# Altium schematic sheet 1166V31-5.SchDoc: HV-Input & Measurement-Driver
size A3; Author: M. Kutzsche; Organization: Kübrich Ing.-Gesellschaft; Address1: mbH & Co. KG; Address2: Weißmühle 10; Address3: D-96170 Priesendorf; DocumentNumber: UltraZohm; Revision: 31; SheetNumber: 5; SheetTotal: 5
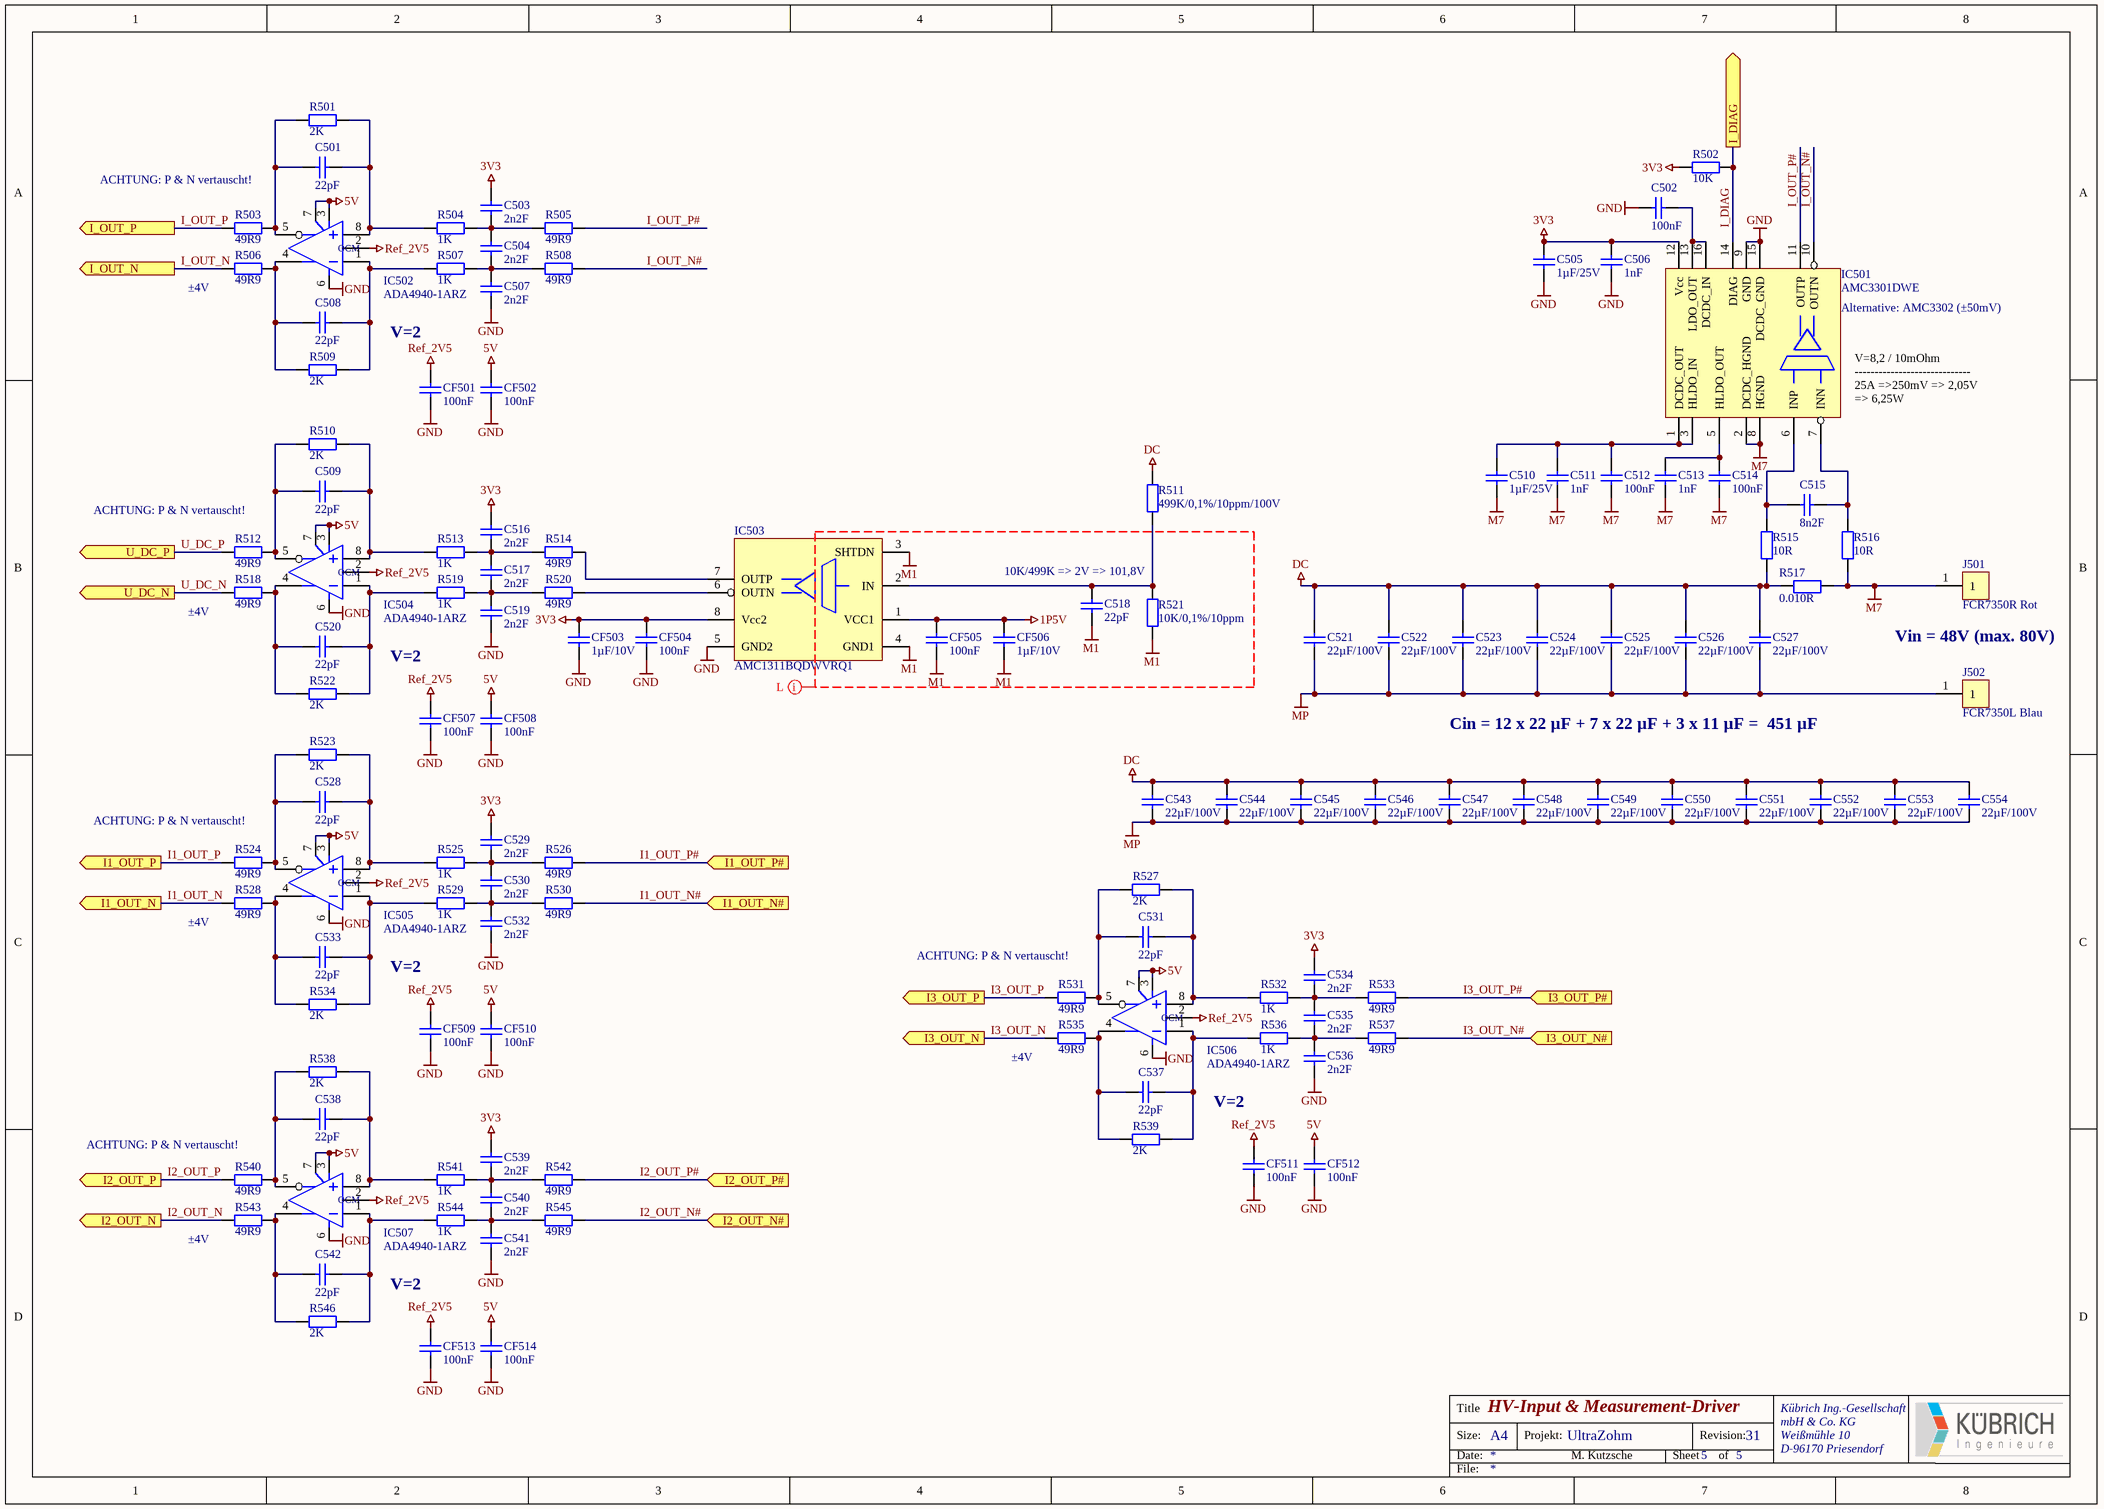
[diagram p0: 1166V31-5.SchDoc]

## Parts
C501  22pF  [0603-Cap]
C502  100nF  [0603-Cap]
C503  2n2F  [0603-Cap]
C504  2n2F  [0603-Cap]
C505  1µF/25V  [1206-Cap]
C506  1nF  [1206-Cap]
C507  2n2F  [0603-Cap]
C508  22pF  [0603-Cap]
C509  22pF  [0603-Cap]
C510  1µF/25V  [0603-Cap]
C511  1nF  [0603-Cap]
C512  100nF  [0603-Cap]
C513  1nF  [1206-Cap]
C514  100nF  [1206-Cap]
C515  8n2F  [0603-Cap]
C516  2n2F  [0603-Cap]
C517  2n2F  [0603-Cap]
C518  22pF  [0603-Cap]
C519  2n2F  [0603-Cap]
C520  22pF  [0603-Cap]
C521  22µF/100V  [2220-Cap]
C522  22µF/100V  [2220-Cap]
C523  22µF/100V  [2220-Cap]
C524  22µF/100V  [2220-Cap]
C525  22µF/100V  [2220-Cap]
C526  22µF/100V  [2220-Cap]
C527  22µF/100V  [2220-Cap]
C528  22pF  [0603-Cap]
C529  2n2F  [0603-Cap]
C530  2n2F  [0603-Cap]
C531  22pF  [0603-Cap]
C532  2n2F  [0603-Cap]
C533  22pF  [0603-Cap]
C534  2n2F  [0603-Cap]
C535  2n2F  [0603-Cap]
C536  2n2F  [0603-Cap]
C537  22pF  [0603-Cap]
C538  22pF  [0603-Cap]
C539  2n2F  [0603-Cap]
C540  2n2F  [0603-Cap]
C541  2n2F  [0603-Cap]
C542  22pF  [0603-Cap]
C543  22µF/100V  [2220-Cap]
C544  22µF/100V  [2220-Cap]
C545  22µF/100V  [2220-Cap]
C546  22µF/100V  [2220-Cap]
C547  22µF/100V  [2220-Cap]
C548  22µF/100V  [2220-Cap]
C549  22µF/100V  [2220-Cap]
C550  22µF/100V  [2220-Cap]
C551  22µF/100V  [2220-Cap]
C552  22µF/100V  [2220-Cap]
C553  22µF/100V  [2220-Cap]
C554  22µF/100V  [2220-Cap]
CF501  100nF  [0603-Cap]
CF502  100nF  [0603-Cap]
CF503  1µF/10V  [0603-Cap]
CF504  100nF  [0603-Cap]
CF505  100nF  [0603-Cap]
CF506  1µF/10V  [0603-Cap]
CF507  100nF  [0603-Cap]
CF508  100nF  [0603-Cap]
CF509  100nF  [0603-Cap]
CF510  100nF  [0603-Cap]
CF511  100nF  [0603-Cap]
CF512  100nF  [0603-Cap]
CF513  100nF  [0603-Cap]
CF514  100nF  [0603-Cap]
IC501  AMC3301DWE  [SOIC-16-W - 8.1mm]
IC502  ADA4940-1ARZ  [SOIC-8-N]
IC503  AMC1311BQDWVRQ1  [SOIC-8-W]
IC504  ADA4940-1ARZ  [SOIC-8-N]
IC505  ADA4940-1ARZ  [SOIC-8-N]
IC506  ADA4940-1ARZ  [SOIC-8-N]
IC507  ADA4940-1ARZ  [SOIC-8-N]
J501  FCR7350R Rot  [SLB4-I/90 - 4mm - rot - CLIFF]
J502  FCR7350L Blau  [SLB4-I/90 - 4mm - Blau - CLIFF]
R501  2K  [0603-Res]
R502  10K  [0603-Res]
R503  49R9  [0603-Res]
R504  1K  [0603-Res]
R505  49R9  [0603-Res]
R506  49R9  [0603-Res]
R507  1K  [0603-Res]
R508  49R9  [0603-Res]
R509  2K  [0603-Res]
R510  2K  [0603-Res]
R511  499K/0,1%/10ppm/100V  [0805-Res]
R512  49R9  [0603-Res]
R513  1K  [0603-Res]
R514  49R9  [0603-Res]
R515  10R  [0603-Res]
R516  10R  [0603-Res]
R517  0.010R  [GMR320]
R518  49R9  [0603-Res]
R519  1K  [0603-Res]
R520  49R9  [0603-Res]
R521  10K/0,1%/10ppm  [0603-Res]
R522  2K  [0603-Res]
R523  2K  [0603-Res]
R524  49R9  [0603-Res]
R525  1K  [0603-Res]
R526  49R9  [0603-Res]
R527  2K  [0603-Res]
R528  49R9  [0603-Res]
R529  1K  [0603-Res]
R530  49R9  [0603-Res]
R531  49R9  [0603-Res]
R532  1K  [0603-Res]
R533  49R9  [0603-Res]
R534  2K  [0603-Res]
R535  49R9  [0603-Res]
R536  1K  [0603-Res]
R537  49R9  [0603-Res]
R538  2K  [0603-Res]
R539  2K  [0603-Res]
R540  49R9  [0603-Res]
R541  1K  [0603-Res]
R542  49R9  [0603-Res]
R543  49R9  [0603-Res]
R544  1K  [0603-Res]
R545  49R9  [0603-Res]
R546  2K  [0603-Res]

## Ports
I1_OUT_N (out), I1_OUT_N# (in), I1_OUT_P (out), I1_OUT_P# (in), I2_OUT_N (out), I2_OUT_N# (in), I2_OUT_P (out), I2_OUT_P# (in), I3_OUT_N (out), I3_OUT_N# (in), I3_OUT_P (out), I3_OUT_P# (in), I_DIAG (out), I_OUT_N (out), I_OUT_P (out), U_DC_N (out), U_DC_P (out)

## Nets
1P5V: CF505.1 CF506.1 IC503.1(VCC1)
3V3: C503.2 C505.1 C506.1 C516.2 C529.2 C534.2 C539.2 CF503.1 CF504.1 IC501.12(Vcc) IC503.8(Vcc2) R502.2
5V: CF502.1 CF508.1 CF510.1 CF512.1 CF514.1 IC502.3(V+) IC502.7(EN) IC504.3(V+) IC504.7(EN) IC505.3(V+) IC505.7(EN) IC506.3(V+) IC506.7(EN) IC507.3(V+) IC507.7(EN)
DC: C521.1 C522.1 C523.1 C524.1 C525.1 C526.1 C527.1 C543.1 C544.1 C545.1 C546.1 C547.1 C548.1 C549.1 C550.1 C551.1 C552.1 C553.1 C554.1 R511.2 R515.1 R517.2
GND: C502.1 C505.2 C506.2 C507.1 C519.1 C532.1 C536.1 C541.1 CF501.2 CF502.2 CF503.2 CF504.2 CF507.2 CF508.2 CF509.2 CF510.2 CF511.2 CF512.2 CF513.2 CF514.2 IC501.9(GND) IC501.15(DCDC_GND) IC502.6(V-) IC503.5(GND2) IC504.6(V-) IC505.6(V-) IC506.6(V-) IC507.6(V-)
M1: C518.1 CF505.2 CF506.2 IC503.3(SHTDN) IC503.4(GND1) R521.2
M7: C510.2 C511.2 C512.2 C513.2 C514.2 IC501.2(DCDC_HGND) IC501.8(HGND) J501.1 R516.1 R517.1
MP: C521.2 C522.2 C523.2 C524.2 C525.2 C526.2 C527.2 C543.2 C544.2 C545.2 C546.2 C547.2 C548.2 C549.2 C550.2 C551.2 C552.2 C553.2 C554.2 J502.1
Ref_2V5: CF501.1 CF507.1 CF509.1 CF511.1 CF513.1 IC502.2(OCM) IC504.2(OCM) IC505.2(OCM) IC506.2(OCM) IC507.2(OCM)
I1_OUT_N: R528.2 ; port I1_OUT_N
I1_OUT_N#: R530.1 ; port I1_OUT_N#
I1_OUT_P: R524.2 ; port I1_OUT_P
I1_OUT_P#: R526.1 ; port I1_OUT_P#
I2_OUT_N: R543.2 ; port I2_OUT_N
I2_OUT_N#: R545.1 ; port I2_OUT_N#
I2_OUT_P: R540.2 ; port I2_OUT_P
I2_OUT_P#: R542.1 ; port I2_OUT_P#
I3_OUT_N: R535.2 ; port I3_OUT_N
I3_OUT_N#: R537.1 ; port I3_OUT_N#
I3_OUT_P: R531.2 ; port I3_OUT_P
I3_OUT_P#: R533.1 ; port I3_OUT_P#
I_DIAG: IC501.14(DIAG) R502.1 ; port I_DIAG
I_OUT_N: R506.2 ; port I_OUT_N
I_OUT_N#: IC501.10(OUTN) R508.1
I_OUT_P: R503.2 ; port I_OUT_P
I_OUT_P#: IC501.11(OUTP) R505.1
U_DC_N: R518.2 ; port U_DC_N
U_DC_P: R512.2 ; port U_DC_P
NetC501_1: C501.1 IC502.8(+) R501.1 R504.2
NetC501_2: C501.2 IC502.5(Out) R501.2 R503.1
NetC502_2: C502.2 IC501.13(LDO_OUT) IC501.16(DCDC_IN)
NetC503_1: C503.1 C504.2 R504.1 R505.2
NetC504_1: C504.1 C507.2 R507.1 R508.2
NetC508_1: C508.1 IC502.1(-) R507.2 R509.1
NetC508_2: C508.2 IC502.4(Out) R506.1 R509.2
NetC509_1: C509.1 IC504.8(+) R510.1 R513.2
NetC509_2: C509.2 IC504.5(Out) R510.2 R512.1
NetC510_1: C510.1 C511.1 C512.1 IC501.1(DCDC_OUT) IC501.3(HLDO_IN)
NetC513_1: C513.1 C514.1 IC501.5(HLDO_OUT)
NetC515_1: C515.1 IC501.7(INN) R516.2
NetC515_2: C515.2 IC501.6(INP) R515.2
NetC516_1: C516.1 C517.2 R513.1 R514.2
NetC517_1: C517.1 C519.2 R519.1 R520.2
NetC518_2: C518.2 IC503.2(IN) R511.1 R521.1
NetC520_1: C520.1 IC504.1(-) R519.2 R522.1
NetC520_2: C520.2 IC504.4(Out) R518.1 R522.2
NetC528_1: C528.1 IC505.8(+) R523.1 R525.2
NetC528_2: C528.2 IC505.5(Out) R523.2 R524.1
NetC529_1: C529.1 C530.2 R525.1 R526.2
NetC530_1: C530.1 C532.2 R529.1 R530.2
NetC531_1: C531.1 IC506.8(+) R527.1 R532.2
NetC531_2: C531.2 IC506.5(Out) R527.2 R531.1
NetC533_1: C533.1 IC505.1(-) R529.2 R534.1
NetC533_2: C533.2 IC505.4(Out) R528.1 R534.2
NetC534_1: C534.1 C535.2 R532.1 R533.2
NetC535_1: C535.1 C536.2 R536.1 R537.2
NetC537_1: C537.1 IC506.1(-) R536.2 R539.1
NetC537_2: C537.2 IC506.4(Out) R535.1 R539.2
NetC538_1: C538.1 IC507.8(+) R538.1 R541.2
NetC538_2: C538.2 IC507.5(Out) R538.2 R540.1
NetC539_1: C539.1 C540.2 R541.1 R542.2
NetC540_1: C540.1 C541.2 R544.1 R545.2
NetC542_1: C542.1 IC507.1(-) R544.2 R546.1
NetC542_2: C542.2 IC507.4(Out) R543.1 R546.2
NetIC503_6: IC503.6(OUTN) R520.1
NetIC503_7: IC503.7(OUTP) R514.1

## Layout directives
net class L: 1P5V, M1

## Notes on the sheet
- ACHTUNG: P & N vertauscht!
- (near R506) ±4V
- (near IC501) Alternative: AMC3302 (±50mV)
- V=2
- (near IC501) V=8,2 / 10mOhm
  -----------------------------
  25A =>250mV => 2,05V
  => 6,25W
- (near R512) ACHTUNG: P & N vertauscht!
- 10K/499K => 2V => 101,8V
- (near R518) ±4V
- Vin = 48V (max. 80V)
- Cin = 12 x 22 µF + 7 x 22 µF + 3 x 11 µF =  451 µF
- (near R524) ACHTUNG: P & N vertauscht!
- (near R528) ±4V
- (near R531) ACHTUNG: P & N vertauscht!
- (near R535) ±4V
- (near R540) ACHTUNG: P & N vertauscht!
- (near R543) ±4V
- Title
- Size:
- Date:
- A4
- Projekt:
- Sheet
- Revision:
- of
- File:

## Library data of the parts
C501-C554 CF501-CF514 = Cap_SMD: Capacitor (SMD); Class I: Pasiv; Class II: Capacitor; Last edited: 20.11.2006 10:25
  C501 C508 C509 C518 C520 C528 C531 C533 C537 C538 C542: value: 22pF
  C502 C512 C514 CF501 CF502 CF504 CF505 CF507-CF514: value: 100nF
  C503 C504 C507 C516 C517 C519 C529 C530 C532 C534-C536 C539-C541: value: 2n2F
  C505 C510: value: 1µF/25V
  C506 C511 C513: value: 1nF
  C515: value: 8n2F
  C521-C527 C543-C554: value: 22µF/100V
  CF503 CF506: value: 1µF/10V
IC501 = AMC3301DWE: ±250 mV Input Voltage Range, Reinforced Isolated Amplifier and High Bandwidth of 300 kHz; Manufacturer: Texas Instruments; Class II: ±250 mV, 300KHz, -40-125°C; Package information: Unknown; Best.-Nr.: DigiKey: 296-AMC3301DWE-ND; Class I: Isolated Amplifier; Datasheet: Unknown; Package reference: SOIC-16-W
IC502 IC504-IC507 = ADA4940-1ARZ: Fully Differential ADC Drivers (-40-125°C); Manufacturer: ANALOG DEVICES; Class I: Analog; Best.-Nr.: Farnell 209-6178; Class II: Fully Differential ADC Drivers (-40-125°C); Datasheet: DSO11449, Ver. Aug 2000; Last edited: 04.01.2007 10:14; Package Reference: SOIC-N-8
IC503 = AMC1311BQDWVRQ1: 2V Input, Automotive High-Impedance, Reinforced Isolated Amplifier for Voltage Sensing; Manufacturer: Texas Instruments; Class II: 2V, 275KHz, -40-125°C; Package information: Unknown; Best.-Nr.: Mouser: 595-AMC1311BQDWVRQ1; Class I: Isolated Amplifier; Datasheet: Unknown; Package reference: SOIC-8-W
J501 = FCR7350R Rot: Labor Winkelbuchsen 4mm Rot; Manufacturer: CLIFF Electronic; Class I: Connectors; Best.-Nr.: Farnell: 185-4508; Class II: Labor Winkelbuchsen 4mm Rot; Last edited: 07.03.2007 13:28
J502 = FCR7350L Blau: Labor Winkelbuchsen 4mm Blau; Manufacturer: CLIFF Electronic; Class I: Connectors; Best.-Nr.: Farnell: 185-4511; Class II: Labor Winkelbuchsen 4mm Blau; Last edited: 07.03.2007 13:28
R501-R516 R518-R546 = Res_SMD: Resistor SMD; Class I: Pasiv; Class II: Resistor; Last edited: 17.11.2006 11:38
  R501 R509 R510 R522 R523 R527 R534 R538 R539 R546: value: 2K
  R502: value: 10K
  R503 R505 R506 R508 R512 R514 R518 R520 R524 R526 R528 R530 R531 R533 R535 R537 R540 R542 R543 R545: value: 49R9
  R504 R507 R513 R519 R525 R529 R532 R536 R541 R544: value: 1K
  R511: value: 499K/0,1%/10ppm/100V
  R515 R516: value: 10R
  R521: value: 10K/0,1%/10ppm
R517 = GMR320HJBFA10L0: Shunt 0.010R, 10W, 1%, 25ppm; Manufacturer: ROHM; Class I: Pasiv; Class II: Shunt 10W; Best.-Nr.: DigiKey 511-GMR320HJBFA10L0CT-ND; Mouser: 755-GMR320HJBFA10L0; Last edited: 23.11.2006 14:12; value: 0.010R